# Altium project PCB_Project.PrjPcb (part 2 of 2)

## Sheet Sheet1.SchDoc
size A3
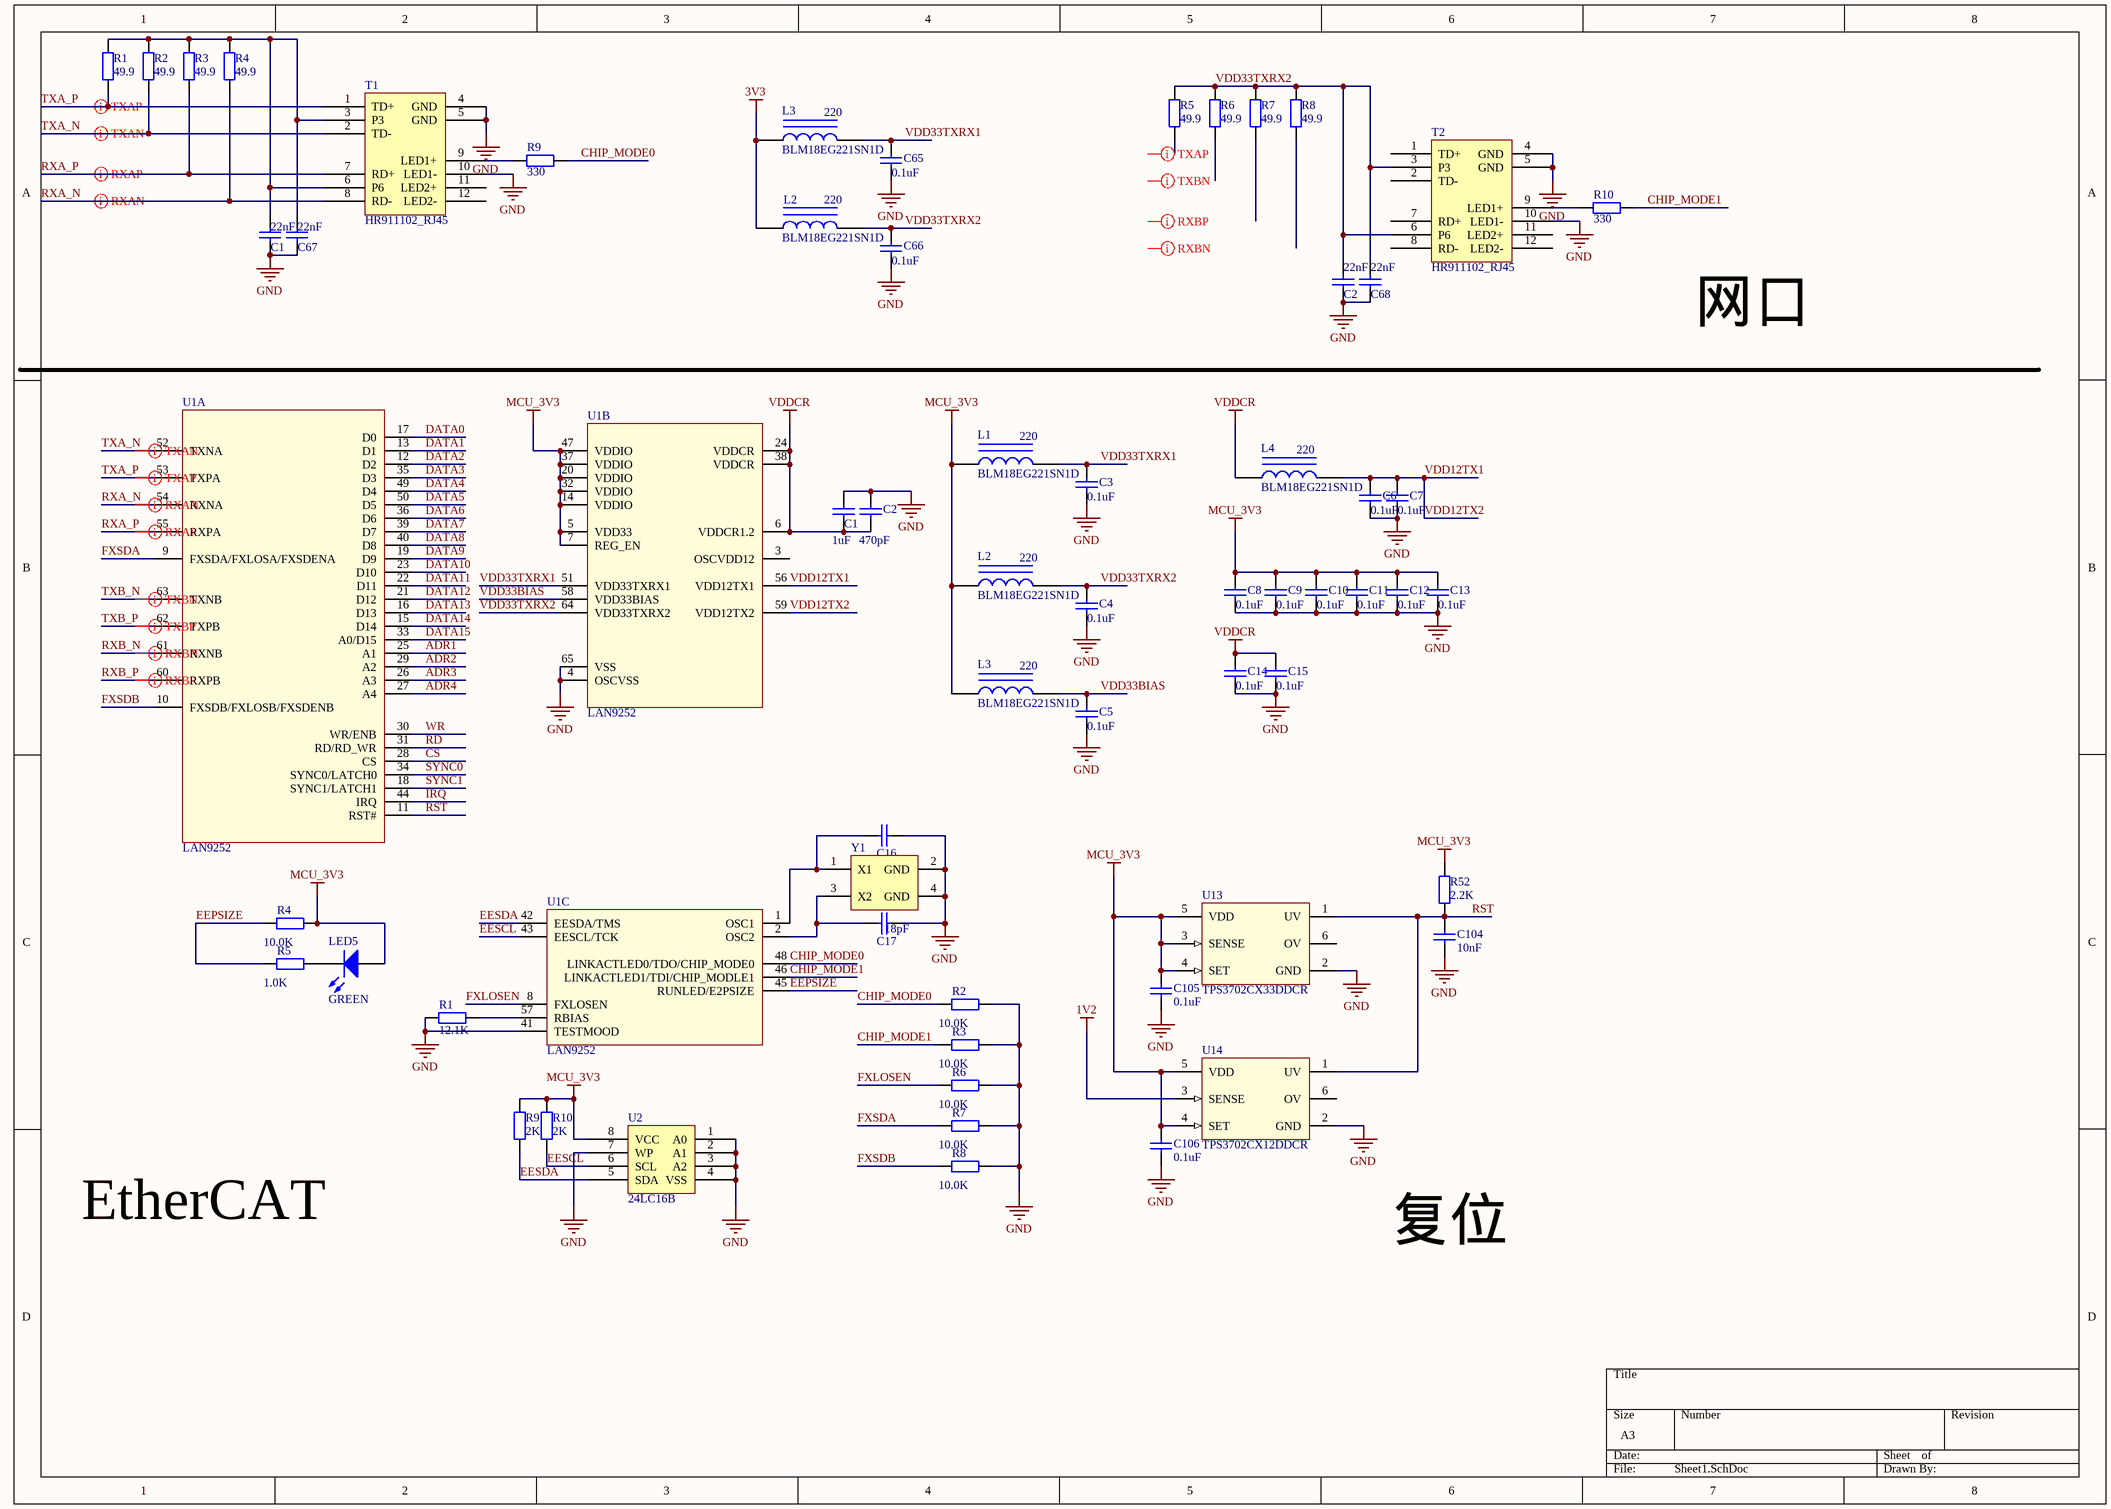
[diagram p4: Sheet1.SchDoc]

### Parts
(Parts that share a designator on the sheet are numbered #1, #2 ... from top to bottom, then left to right.)
C1#3  value 22nF  [CC1608-0603]  (hidden comment: 0603B223J6R3NT)
C1#4  value 1uF  [CC1608-0603]  (hidden comment: 0603B105J6R3NT)
C2#3  value 22nF  [CC1608-0603]  (hidden comment: 0603B223J6R3NT)
C2#4  value 470pF  [CC1005-0402]  (hidden comment: 0402B471J6R3NT)
C3#3  value 0.1uF  [CC1005-0402]  (hidden comment: 0402B104J6R3NT)
C4#3  value 0.1uF  [CC1005-0402]  (hidden comment: 0402B104J6R3NT)
C5#3  value 0.1uF  [CC1005-0402]  (hidden comment: 0402B104J6R3NT)
C6#3  value 0.1uF  [CC1005-0402]  (hidden comment: 0402B104J6R3NT)
C7#3  value 0.1uF  [CC1005-0402]  (hidden comment: 0402B104J6R3NT)
C8#3  value 0.1uF  [CC1005-0402]  (hidden comment: 0402B104J6R3NT)
C9#3  value 0.1uF  [CC1005-0402]  (hidden comment: 0402B104J6R3NT)
C10#3  value 0.1uF  [CC1005-0402]  (hidden comment: 0402B104J6R3NT)
C11#3  value 0.1uF  [CC1005-0402]  (hidden comment: 0402B104J6R3NT)
C12#3  value 0.1uF  [CC1005-0402]  (hidden comment: 0402B104J6R3NT)
C13#3  value 0.1uF  [CC1005-0402]  (hidden comment: 0402B104J6R3NT)
C14#3  value 0.1uF  [CC1005-0402]  (hidden comment: 0402B104J6R3NT)
C15#3  value 0.1uF  [CC1005-0402]  (hidden comment: 0402B104J6R3NT)
C16#3  value 18pF  [CC1005-0402]  (hidden comment: 0402B180J6R3NT)
C17#3  Vaule: 18pF  [CC1005-0402]  (hidden comment: 0402B180J6R3NT)
C65#3  value 0.1uF  [CC1608-0603]  (hidden comment: 0402B104J6R3NT)
C66#3  value 0.1uF  [CC1608-0603]  (hidden comment: 0402B104J6R3NT)
C67#3  value 22nF  [CC1608-0603]  (hidden comment: 0603B223J6R3NT)
C68#2  value 22nF  [CC1608-0603]  (hidden comment: 0603B223J6R3NT)
C104#2  value 10nF  [CC1005-0402]  (hidden comment: 0402B103J6R3NT)
C105#2  value 0.1uF  [CC1005-0402]  (hidden comment: 0402B104J6R3NT)
C106#2  value 0.1uF  [CC1005-0402]  (hidden comment: 0402B104J6R3NT)
L1#3  BLM18EG221SN1D  value 220  [BLM0603]
L2#3  BLM18EG221SN1D  value 220  [BLM0603]
L2#4  BLM18EG221SN1D  value 220  [BLM0603]
L3#3  BLM18EG221SN1D  value 220  [BLM0603]
L3#4  BLM18EG221SN1D  value 220  [BLM0603]
L4#2  BLM18EG221SN1D  value 220  [BLM0603]
LED5#2  LED Chip  [0603D]  (value not drawn)
R1#3  value 49.9  [CR1608-0603]  (hidden comment: RC03K49R9JT)
R1#4  value 12.1K  [CR1005-0402]  (hidden comment: RC02K1212JT)
R2#3  value 49.9  [CR1608-0603]  (hidden comment: RC03K49R9JT)
R2#4  value 10.0K  [CR1005-0402]  (hidden comment: RC02K6103JT)
R3#3  value 49.9  [CR1608-0603]  (hidden comment: RC03K49R9JT)
R3#4  value 10.0K  [CR1005-0402]  (hidden comment: RC02K6103JT)
R4#3  value 49.9  [CR1608-0603]  (hidden comment: RC03K49R9JT)
R4#4  value 10.0K  [CR1005-0402]  (hidden comment: RC02K6103JT)
R5#3  value 49.9  [CR1608-0603]  (hidden comment: RC03K49R9JT)
R5#4  value 1.0K  [CR1005-0402]  (hidden comment: RC02K6102JT)
R6#3  value 49.9  [CR1608-0603]  (hidden comment: RC03K49R9JT)
R6#4  value 10.0K  [CR1005-0402]  (hidden comment: RC02K6103JT)
R7#3  value 49.9  [CR1608-0603]  (hidden comment: RC03K49R9JT)
R7#4  value 10.0K  [CR1005-0402]  (hidden comment: RC02K6103JT)
R8#3  value 49.9  [CR1608-0603]  (hidden comment: RC03K49R9JT)
R8#4  value 10.0K  [CR1005-0402]  (hidden comment: RC02K6103JT)
R9#3  value 330  [CR1608-0603]  (hidden comment: RC03K331JT)
R9#4  value 2K  [CR1005-0402]  (hidden comment: RC02K202JT)
R10#3  value 330  [CR1608-0603]  (hidden comment: RC03K331JT)
R10#4  value 2K  [CR1005-0402]  (hidden comment: RC02K202JT)
R52#3  value 2.2K  [CR1005-0402]  (hidden comment: RC02K222JT)
T1#2  HR911102_RJ45  [RJ45]
T2#2  HR911102_RJ45  [RJ45]
U1#3  LAN9252  [LAN9252]  (parts A,B,C of 3)
U2#3  24LC16B  [24FC512]
U13#2  TPS3702CX33DDCR  [TPS3702]
U14#2  TPS3702CX12DDCR  [TPS3702]
Y1#2  25MHz  [7B-20MHz]  (value not drawn)

### Nets
1V2: U14#2.3(SENSE)
3V3: L2#3.1 L3#3.1
GND: C1#3.1 C1#4.2 C2#3.1 C2#4.2 C3#3.1 C4#3.1 C5#3.1 C6#3.1 C7#3.1 C8#3.1 C9#3.1 C10#3.1 C11#3.1 C12#3.1 C13#3.1 C14#3.1 C15#3.1 C16#3.1 C17#3.1 C65#3.1 C66#3.1 C67#3.1 C68#2.1 C104#2.2 C105#2.2 C106#2.2 R1#4.1 R2#4.2 R3#4.2 R6#4.2 R7#4.2 R8#4.2 T1#2.4(GND) T1#2.5(GND) T1#2.10(LED1-) T2#2.4(GND) T2#2.5(GND) T2#2.10(LED1-) U1#3.4(OSCVSS) U1#3.41(TESTMOOD) U1#3.65(VSS) U2#3.1(A0) U2#3.2(A1) U2#3.3(A2) U2#3.4(VSS) U2#3.7(WP) U13#2.2(GND) U14#2.2(GND) Y1#2.2(GND) Y1#2.4(GND)
MCU_3V3: C8#3.2 C9#3.2 C10#3.2 C11#3.2 C12#3.2 C13#3.2 C105#2.1 C106#2.1 L1#3.1 L2#4.1 L3#4.1 LED5#2.1(A) R4#4.2 R9#4.2 R10#4.2 R52#3.2 U1#3.5(VDD33) U1#3.7(REG_EN) U1#3.14(VDDIO) U1#3.20(VDDIO) U1#3.32(VDDIO) U1#3.37(VDDIO) U1#3.47(VDDIO) U2#3.8(VCC) U13#2.3(SENSE) U13#2.4(SET) U13#2.5(VDD) U14#2.4(SET) U14#2.5(VDD)
VDDCR: C1#4.1 C2#4.1 C14#3.2 C15#3.2 L4#2.1 U1#3.6(VDDCR1.2) U1#3.24(VDDCR) U1#3.38(VDDCR)
ADR1: U1#3.25(A1)
ADR2: U1#3.29(A2)
ADR3: U1#3.26(A3)
ADR4: U1#3.27(A4)
CHIP_MODE0: R2#4.1 R9#3.1 U1#3.48(LINKACTLED0/TDO/CHIP_MODE0)
CHIP_MODE1: R3#4.1 R10#3.1 U1#3.46(LINKACTLED1/TDI/CHIP_MODLE1)
CS: U1#3.28(CS)
DATA0: U1#3.17(D0)
DATA1: U1#3.13(D1)
DATA2: U1#3.12(D2)
DATA3: U1#3.35(D3)
DATA4: U1#3.49(D4)
DATA5: U1#3.50(D5)
DATA6: U1#3.36(D6)
DATA7: U1#3.39(D7)
DATA8: U1#3.40(D8)
DATA9: U1#3.19(D9)
DATA10: U1#3.23(D10)
DATA11: U1#3.22(D11)
DATA12: U1#3.21(D12)
DATA13: U1#3.16(D13)
DATA14: U1#3.15(D14)
DATA15: U1#3.33(A0/D15)
EEPSIZE: R4#4.1 R5#4.1 U1#3.45(RUNLED/E2PSIZE)
EESCL: R10#4.1 U1#3.43(EESCL/TCK) U2#3.6(SCL)
EESDA: R9#4.1 U1#3.42(EESDA/TMS) U2#3.5(SDA)
FXLOSEN: R6#4.1 U1#3.8(FXLOSEN)
FXSDA: R7#4.1 U1#3.9(FXSDA/FXLOSA/FXSDENA)
FXSDB: R8#4.1 U1#3.10(FXSDB/FXLOSB/FXSDENB)
IRQ: U1#3.44(IRQ)
RD: U1#3.31(RD/RD_WR)
RST: C104#2.1 R52#3.1 U1#3.11(RST#) U13#2.1(UV) U14#2.1(UV)
RXA_N: R4#3.1 T1#2.8(RD-) U1#3.54(RXNA)
RXA_P: R3#3.1 T1#2.7(RD+) U1#3.55(RXPA)
RXB_N: U1#3.61(RXNB)
RXB_P: U1#3.60(RXPB)
SYNC0: U1#3.34(SYNC0/LATCH0)
SYNC1: U1#3.18(SYNC1/LATCH1)
TXA_N: R2#3.1 T1#2.2(TD-) U1#3.52(TXNA)
TXA_P: R1#3.1 T1#2.1(TD+) U1#3.53(TXPA)
TXB_N: U1#3.63(TXNB)
TXB_P: U1#3.62(TXPB)
VDD12TX1: C6#3.2 C7#3.2 L4#2.2 U1#3.56(VDD12TX1) U1#3.59(VDD12TX2)  [also labelled VDD12TX2]
VDD33BIAS: C5#3.2 L3#4.2 U1#3.58(VDD33BIAS)
VDD33TXRX1: C3#3.2 C65#3.2 L1#3.2 L3#3.2 U1#3.51(VDD33TXRX1)
VDD33TXRX2: C2#3.2 C4#3.2 C66#3.2 C68#2.2 L2#3.2 L2#4.2 R5#3.2 R6#3.2 R7#3.2 R8#3.2 T2#2.3(P3) T2#2.6(P6) U1#3.64(VDD33TXRX2)
WR: U1#3.30(WR/ENB)
NetC1#3_2: C1#3.2 C67#3.2 R1#3.2 R2#3.2 R3#3.2 R4#3.2 T1#2.3(P3) T1#2.6(P6)
NetC16#3_2: C16#3.2 U1#3.1(OSC1) Y1#2.1(X1)
NetC17#3_2: C17#3.2 U1#3.2(OSC2) Y1#2.3(X2)
NetLED5#2_2: LED5#2.2(K) R5#4.2
NetR1#4_2: R1#4.2 U1#3.57(RBIAS)
NetR9#3_2: R9#3.2 T1#2.9(LED1+)
NetR10#3_2: R10#3.2 T2#2.9(LED1+)

Not connected (* = marked no-connect by the designer): R5#3 1; R6#3 1; R7#3 1; R8#3 1; T1#2 11(LED2+) 12(LED2-); T2#2 1(TD+) 2(TD-) 7(RD+) 8(RD-) 11(LED2+) 12(LED2-); U1#3 3(OSCVDD12); U13#2 6(OV); U14#2 6(OV)

### Layout directives
differential pair: (no net found under the mark), RXA_N, RXA_P, RXB_N, RXB_P, TXA_N, TXA_P, TXB_N, TXB_P

### Notes on the sheet
- 网口
- EtherCAT
- 复位
- (in symbol LED Chip) GREEN

### Library data of the parts
C1#3 C1#4 C2#3 C2#4 C3#3 C4#3 C5#3 C6#3 C7#3 C8#3 C9#3 C10#3 C11#3 C12#3 C13#3 C14#3 C15#3 C16#3 C17#3 C65#3 C66#3 C67#3 C68#2 C104#2 C105#2 C106#2 = CAP
L1#3 L2#3 L2#4 L3#3 L3#4 L4#2 = Inductor Iron: Magnetic-Core Inductor; Published: *; Revision: *; Publisher: *
LED5#2 = LED Chip: Typical Chip LED; Published: 8-Jun-2000; Revision: July-2002: Re-released for DXP Platform.; Publisher: Altium Limited
R1#3 R1#4 R2#3 R2#4 R3#3 R3#4 R4#3 R4#4 R5#3 R5#4 R6#3 R6#4 R7#3 R7#4 R8#3 R8#4 R9#3 R9#4 R10#3 R10#4 R52#3 = Resistor
U13#2 U14#2 = TPS3702CX33DDCR: Imported; Alternate PartNumber: TPS3702CX33DDCT; Manufacturer: Texas Instruments; CompType: IC; PIN_COUNT: 6; PartNumber: TPS3702CX33DDCR; PackageReference: DDC0006A; MountType: SMT; RefDes: RefDes; Type: DEV; Value: Value
Y1#2 = XTAL1

## Nets that join several sheets
1V2: new (6 pins), Sheet1 (U14#2.3)
3V3: diban (9 pins), new (8 pins), encoder (24 pins), Sheet1 (L2#3.1 L3#3.1)
5V0: diban (9 pins), new (14 pins), encoder (8 pins)
GND: diban (68 pins), new (212 pins), encoder (51 pins), Sheet1 (50 pins)
MCU_3V3: new (96 pins), Sheet1 (29 pins)
VDDCR: new (8 pins), Sheet1 (8 pins)
/RE: new (JP4.19 U3#1.J2), encoder (JP2#2.3 R59#2.2 U8.2)
ADR1: new (U1#1.25 U3#1.A4), Sheet1 (U1#3.25)
ADR2: new (U1#1.29 U3#1.T16), Sheet1 (U1#3.29)
ADR3: new (U1#1.26 U3#1.W17), Sheet1 (U1#3.26)
ADR4: new (U1#1.27 U3#1.V17), Sheet1 (U1#3.27)
BISSC_CLK: new (JP4.17 U3#1.A6), encoder (JP2#2.5 U8.4)
BISSC_DIN: new (JP4.20 U3#1.K3), encoder (JP2#2.4 R58#2.2 U8.1)
CAN_RX: new (JP3.6 U3#1.B2), encoder (5 pins)
CAN_TX: new (JP3.8 U3#1.C2), encoder (5 pins)
CAP1: new (JP4.12 U3#1.V12), encoder (JP2#2.12 JP13.2 R18#2.2)
CAP2: new (JP4.2 U3#1.W10), encoder (JP2#2.22 JP13.1 R17#2.2)
CAP3: new (JP4.14 U3#1.U12), encoder (JP2#2.10 JP13.3 R19#2.2)
CHIP_MODE0: diban (JP8.25 R9#1.1), new (JP1#1.11 R2#2.1 U1#1.48), Sheet1 (R2#4.1 R9#3.1 U1#3.48)
CHIP_MODE1: diban (JP8.23 R10#1.1), new (JP1#1.13 R3#2.1 U1#1.46), Sheet1 (R3#4.1 R10#3.1 U1#3.46)
CS: new (U1#1.28 U3#1.U14), Sheet1 (U1#3.28)
DACC: new (JP4.22 R58#1.1), encoder (JP2#2.2 JP12.10)
DATA0: new (U1#1.17 U3#1.B11), Sheet1 (U1#3.17)
DATA1: new (U1#1.13 U3#1.C14), Sheet1 (U1#3.13)
DATA2: new (U1#1.12 U3#1.B14), Sheet1 (U1#3.12)
DATA3: new (U1#1.35 U3#1.A14), Sheet1 (U1#3.35)
DATA4: new (U1#1.49 U3#1.D15), Sheet1 (U1#3.49)
DATA5: new (U1#1.50 U3#1.C15), Sheet1 (U1#3.50)
DATA6: new (U1#1.36 U3#1.B15), Sheet1 (U1#3.36)
DATA7: new (U1#1.39 U3#1.A15), Sheet1 (U1#3.39)
DATA8: new (U1#1.40 U3#1.C16), Sheet1 (U1#3.40)
DATA9: new (U1#1.19 U3#1.D16), Sheet1 (U1#3.19)
DATA10: new (U1#1.23 U3#1.C17), Sheet1 (U1#3.23)
DATA11: new (U1#1.22 U3#1.A16), Sheet1 (U1#3.22)
DATA12: new (R14#1.2 U1#1.21 U3#1.B16), Sheet1 (U1#3.21)
DATA13: new (U1#1.16 U3#1.B17), Sheet1 (U1#3.16)
DATA14: new (U1#1.15 U3#1.A17), Sheet1 (U1#3.15)
DATA15: new (U1#1.33 U3#1.B18), Sheet1 (U1#3.33)
DC_CAL: diban (JP8.19 U7#1.12), new (JP1#1.17 U3#1.D1)
DE: new (JP4.18 U3#1.J1), encoder (JP2#2.6 R81.1 U8.3)
DigIN1: new (JP4.15 U3#1.V8), encoder (JP2#2.7 R29.1 U4#2.10)
DigIN2: new (JP4.13 U3#1.U9), encoder (JP2#2.9 R28.1 U4#2.12)
DigIN3: new (JP4.11 U3#1.V10), encoder (JP2#2.11 R27.1 U4#2.14)
DigIN4: new (JP4.9 U3#1.V11), encoder (JP2#2.13 R26.1 U4#2.16)
DigOUT1: new (JP4.3 U3#1.W16), encoder (JP2#2.17 R43.2)
DigOUT2: new (JP4.1 U3#1.V16), encoder (JP2#2.19 R30.2)
DigOUT3: new (JP4.7 U3#1.U13), encoder (JP2#2.15 R42.2)
DigOUT4: new (JP4.5 U3#1.U15), encoder (JP2#2.21 R31.2)
EEPSIZE: new (R4#2.1 R5#2.1 U1#1.45), Sheet1 (R4#4.1 R5#4.1 U1#3.45)
EESCL: new (R10#2.1 U1#1.43 U2#1.6), Sheet1 (R10#4.1 U1#3.43 U2#3.6)
EESDA: new (R9#2.1 U1#1.42 U2#1.5), Sheet1 (R9#4.1 U1#3.42 U2#3.5)
EN_GATE: diban (JP8.8 R60#1.2 U7#1.16), new (JP1#1.30 U3#1.A2)
FXLOSEN: new (R6#2.1 U1#1.8), Sheet1 (R6#4.1 U1#3.8)
FXSDA: new (R7#2.1 U1#1.9), Sheet1 (R7#4.1 U1#3.9)
FXSDB: new (R8#2.1 U1#1.10), Sheet1 (R8#4.1 U1#3.10)
INH_A: diban (JP8.18 U7#1.17), new (JP1#1.20 U3#1.C8)
INH_B: diban (JP8.15 U7#1.19), new (JP1#1.21 U3#1.A7)
INH_C: diban (JP8.14 U7#1.21), new (JP1#1.24 U3#1.C7)
INL_A: diban (JP8.16 U7#1.18), new (JP1#1.22 U3#1.D8)
INL_B: diban (JP8.13 U7#1.20), new (JP1#1.23 U3#1.B7)
INL_C: diban (JP8.12 U7#1.22), new (JP1#1.26 U3#1.D7)
IRQ: new (U1#1.44 U3#1.T11), Sheet1 (U1#3.44)
LED1: diban (JP9.7 LED1.1), new (JP2#1.29 U3#1.W18)
LED2: diban (JP9.18 LED2.1), new (JP2#1.20 U3#1.W11)
LED3: diban (JP9.16 LED3.1), new (JP2#1.22 U3#1.W9)
nFAULT: diban (JP8.20 R51#1.1 U7#1.6), new (JP1#1.18 U3#1.D2)
nOCTW: diban (JP8.17 R52#1.1 U7#1.5), new (JP1#1.19 U3#1.C1)
QEP1A: new (JP4.6 U3#1.R18), encoder (C4#2.1 JP2#2.18 R14#2.1)
QEP1B: new (JP4.4 U3#1.R19), encoder (C6#2.2 JP2#2.20 R16#2.1)
QEP1I: new (JP4.10 U3#1.P17), encoder (C5#2.2 JP2#2.14 R15#2.1)
RD: new (U1#1.31 U3#1.U16), Sheet1 (U1#3.31)
RST: new (6 pins), Sheet1 (5 pins)
RXA_N: diban (JP8.33 R4#1.1 T1#1.8), new (JP1#1.3 U1#1.54), Sheet1 (R4#3.1 T1#2.8 U1#3.54)
RXA_P: diban (JP8.35 R3#1.1 T1#1.7), new (JP1#1.1 U1#1.55), Sheet1 (R3#3.1 T1#2.7 U1#3.55)
RXB_N: diban (JP8.34 R8#1.1 T2#1.8), new (JP1#1.4 U1#1.61), Sheet1 (U1#3.61)
RXB_P: diban (JP8.36 R7#1.1 T2#1.7), new (JP1#1.2 U1#1.60), Sheet1 (U1#3.60)
SCI_RXD: new (JP3.4 U3#1.A3), encoder (JP1#2.10 U3#2.9)
SCI_TXD: new (JP3.2 U3#1.B4), encoder (JP1#2.12 U3#2.11)
SPIA_CLK: diban (JP8.24 U7#1.11), new (JP1#1.14 U3#1.E3)
SPIA_CS: diban (JP8.21 U7#1.8), new (JP1#1.15 U3#1.E4)
SPIA_SIMO: diban (JP8.22 U7#1.9), new (JP1#1.16 U3#1.E1)
SPIA_SOMI: diban (JP8.26 U7#1.10), new (JP1#1.12 U3#1.E2)
SYNC0: new (U1#1.34 U3#1.D6), Sheet1 (U1#3.34)
SYNC1: new (U1#1.18 U3#1.B19), Sheet1 (U1#3.18)
TXA_N: diban (JP8.29 R2#1.1 T1#1.2), new (JP1#1.7 U1#1.52), Sheet1 (R2#3.1 T1#2.2 U1#3.52)
TXA_P: diban (JP8.31 R1#1.1 T1#1.1), new (JP1#1.5 U1#1.53), Sheet1 (R1#3.1 T1#2.1 U1#3.53)
TXB_N: diban (JP8.30 R6#1.1 T2#1.2), new (JP1#1.8 U1#1.63), Sheet1 (U1#3.63)
TXB_P: diban (JP8.32 R5#1.1 T2#1.1), new (JP1#1.6 U1#1.62), Sheet1 (U1#3.62)
VDD12TX1: new (5 pins), Sheet1 (5 pins)
VDD33BIAS: new (C5#1.2 L3#2.2 U1#1.58), Sheet1 (C5#3.2 L3#4.2 U1#3.58)
VDD33TXRX1: diban (10 pins), new (C3#1.2 L1#2.2 U1#1.51), Sheet1 (5 pins)
VDD33TXRX2: diban (10 pins), new (C4#1.2 L2#2.2 U1#1.64), Sheet1 (13 pins)
WR: new (U1#1.30 U3#1.U11), Sheet1 (U1#3.30)